# EasyEDA Pro project ProPrj_Anniversary_2026-05-06.epro, board LCD_TFT_Breakout_1in8_128x160
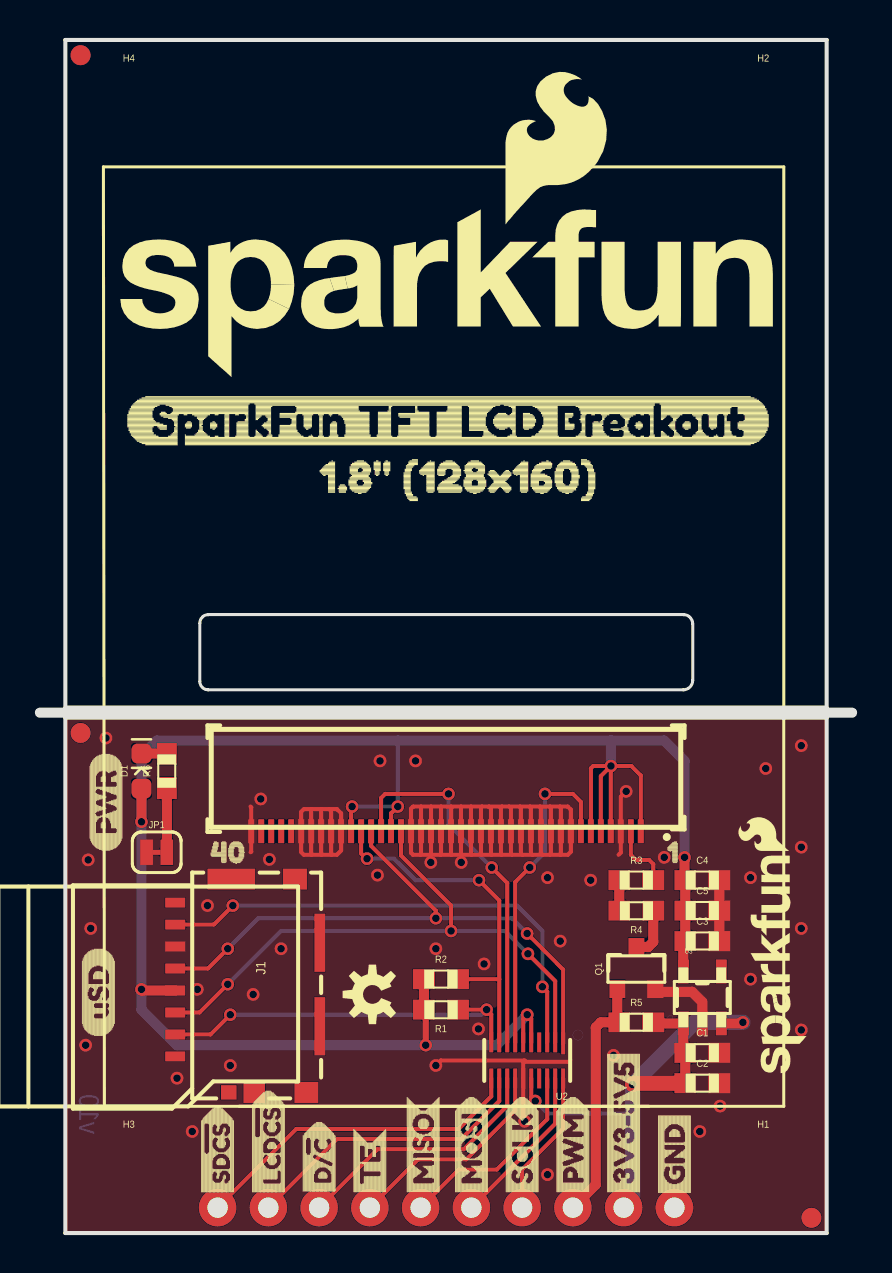
[diagram p3: board, top side]
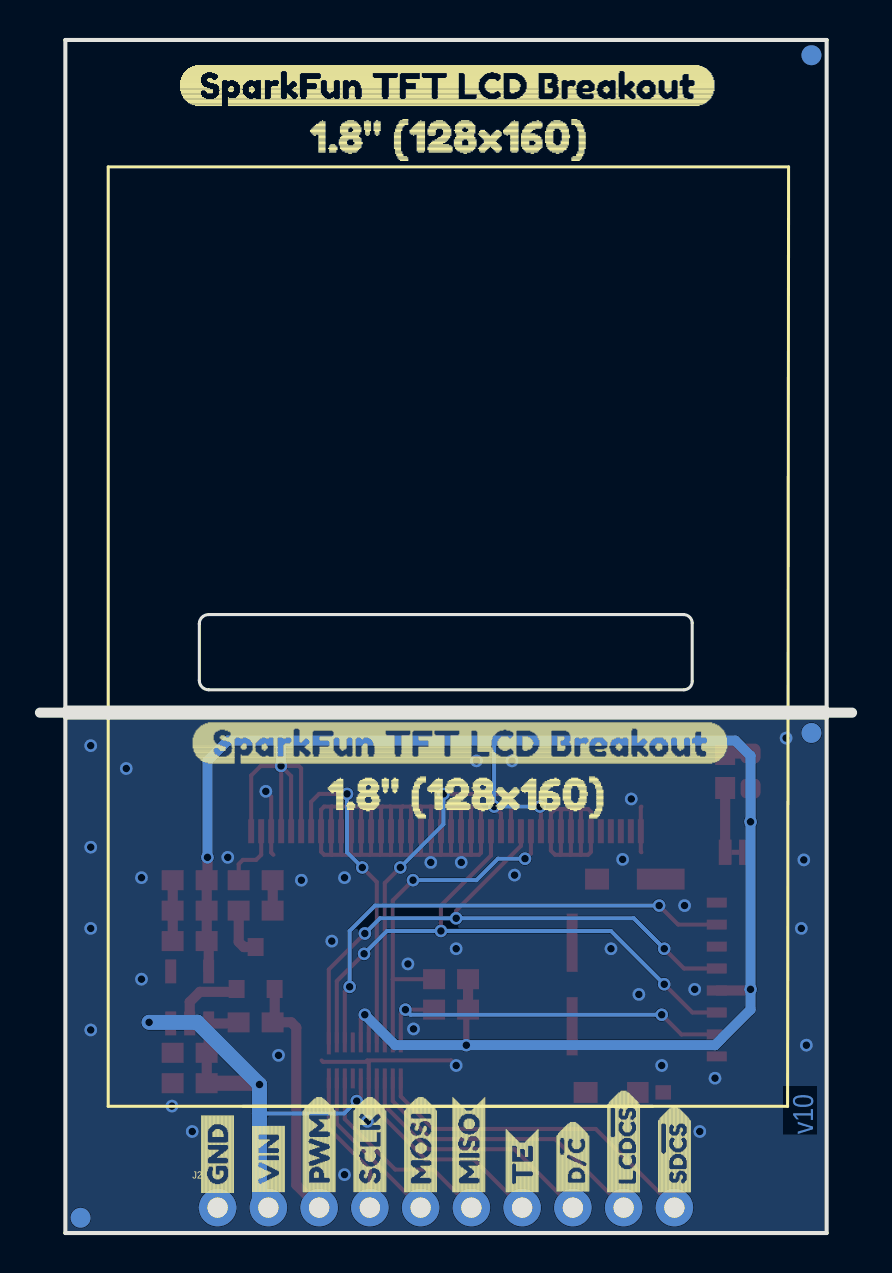
[diagram p4: board, bottom side, seen from below]

Outline 40.64 x 59.69 mm; copper layers: Top Layer, Bottom Layer. Coordinates in mm from the lower left corner of the outline.
Outline path: 0,26.03 40.64,26.03 ; 1.27,59.69 1.27,26.29 39.37,26.29 39.37,59.69 1.27,59.69 ; 1.27,25.78 39.37,25.78 39.37,0 1.27,0 1.27,25.78 ; 8,30.51 arc(8.12,30.81) 8.43,30.94 32.21,30.94 arc(32.53,30.81) 32.67,30.48 32.67,27.65 arc(32.53,27.32) 32.2,27.18 8.42,27.18 arc(8.12,27.3) 8,27.6 8,30.51
Stack: Top Layer 0.035mm / Dielectric1 1.51mm FR4 er 4.5 / Bottom Layer 0.035mm

## Design rules (mm)
spacing safeClearance (default): track to track 0.102, other pairs 0 to 0.102
track width trackWidth: min 0.102, default 0.102, max 2.54
track width default (default): min 0.003, default 0.003, max 2.54
differential pair differentialPair (default): width min 0.127, default 0.254, max 2.54; gap min 0.152, default 0.152
via viaSize: diameter min 0.152, default 0.152, max 2.6; hole min 0.152, default 0.152, max 2
via default (default): diameter min 0, default 0, max 2.6; hole min 0, default 0, max 2
net GND uses CopperRegion1
pour ie27 uses CopperRegion
pour ie28 uses CopperRegion1

## Placement (name value [footprint] x y rotation side)
C1  1.0uF  [0603]  33.15 9.02 0 top
C2  0.1uF  [0603]  33.15 7.49 0 top
C3  4.7uF  [0603]  33.15 14.61 0 top
C4  1.0uF  [0603]  33.15 17.65 0 top
C5  0.1uF  [0603]  33.15 16.13 0 top
D1  RED  [LED-0603]  5.08 23.11 90 top
FD1  FIDUCIAL1X2  [FIDUCIAL-1X2]  2.03 58.93 0 top
FD2  FIDUCIAL1X2  [FIDUCIAL-1X2]  38.61 0.76 0 top
FD3  FIDUCIAL1X2  [FIDUCIAL-1X2]  2.03 58.93 180 bottom
FD4  FIDUCIAL1X2  [FIDUCIAL-1X2]  38.61 0.76 180 bottom
FD5  FIDUCIAL1X2  [FIDUCIAL-1X2]  2.03 25.02 0 top
FD6  FIDUCIAL1X2  [FIDUCIAL-1X2]  2.03 25.02 180 bottom
FRAME1  FRAME-LETTER  [CREATIVE_COMMONS]  1.27 -23.11 0 top
H1  -  [STAND-OFF]  36.2 3.17 0 top
H2  -  [STAND-OFF]  36.2 56.52 0 top
H3  -  [STAND-OFF]  4.45 3.17 0 top
H4  -  [STAND-OFF]  4.45 56.52 0 top
J1  MICRO-SD_CARD_SOCKETTINY  [MICROSD_TINY]  7.62 18.03 270 top
J2  CONN_10NO_SILK_PTH_FEMALE  [1X10_NO_SILK]  31.75 1.27 180 bottom
JP1  LED  [SMT-JUMPER_2_NC_TRACE_SILK]  5.84 19.05 0 top
LOGO1  SFE_LOGO_NAME_FLAME.3_INCH  [SFE_LOGO_NAME_FLAME_.3]  20.32 46.99 0 top
LOGO2  SPECIAL_INSTRUCTIONS-PRODUCTION  [PRODUCTION_INSTRUCTIONS]  -23.24 -40.39 0 top
LOGO3  OSHW-LOGOS  [OSHW-LOGO-S]  16.64 11.94 90 top
Q1  220mA/50V/3.5Ω  [SOT23-3]  29.84 13.21 0 top
R1  10k  [0603]  20.07 11.18 180 top
R2  10k  [0603]  20.07 12.7 0 top
R3  1  [0603]  29.84 17.65 0 top
R4  1  [0603]  29.84 16.13 180 top
R5  10k  [0603]  29.84 10.54 0 top
R6  1k  [0603]  6.35 23.11 90 top
U1  KWH018ST14-F01_4WSPI-BOTTOM  [FPC05040-17204]  20.32 20.7 180 top
U2  TXB0108DQSR  [UFDFN-20]  24.38 8.64 180 top
U3  3.3V  [SOT23-5]  33.15 11.79 0 top
U$1  -  [3V3#5V50]  29.21 1.52 90 top
U$2  -  [SFE_LOGO_NAME_.1]  36.96 13.46 90 top
U$3  -  [SFE_LOGO_FLAME_.1]  36.2 19.94 90 top
U$4  -  [USD2]  2.92 9.78 90 top
U$5  -  [LCD#CS1]  11.43 1.4 90 top
U$6  -  [LCD#CS1]  11.43 1.4 90 bottom
U$7  -  [D##C7]  13.97 1.4 90 bottom
U$8  -  [SD#CS0]  8.89 1.4 90 top
U$9  -  [GND0]  31.75 1.52 90 bottom
U$10  -  [VIN1]  29.21 1.52 90 bottom
U$11  -  [MISO3]  19.18 1.52 90 bottom
U$12  -  [MOSI2]  21.59 1.52 90 bottom
U$13  -  [SCLK4]  24.13 1.52 90 bottom
U$14  -  [TE5]  16.51 1.52 90 bottom
U$15  -  [PWM6]  26.67 1.52 90 bottom
U$16  -  [SD#CS0]  8.89 1.4 90 bottom
U$17  -  [10]  30.48 19.05 0 top
U$18  -  [PWR4]  3.3 19.05 90 top
U$19  -  [SPARKFUN_TFT_LCD_BREAKOUT1]  4.19 40.64 0 top
U$20  -  [1#8#_#128X160#1]  12.67 37.85 0 top
U$21  -  [SPARKFUN_TFT_LCD_BREAKOUT2]  33.78 57.4 180 bottom
U$22  -  [1#8#_#128X160#0]  28.45 54.86 180 bottom
U$23  -  [SPARKFUN_TFT_LCD_BREAKOUT2]  33.15 24.51 180 bottom
U$24  -  [1#8#_#128X160#0]  27.56 21.97 180 bottom
U$25  -  [D##C7]  13.97 1.4 90 top
U$26  -  [MISO3]  19.18 1.52 90 top
U$27  -  [MOSI2]  21.59 1.52 90 top
U$28  -  [SCLK4]  24.13 1.52 90 top
U$29  -  [TE5]  16.51 1.52 90 top
U$30  -  [PWM6]  26.67 1.52 90 top
U$31  -  [401]  7.62 19.05 0 top
U$32  -  [GND0]  31.75 1.52 90 top
U$33  EXTERNAL_DISP-KWH018ST14-F01  [KWH018ST14-F01_HOLES]  3.18 53.34 180 bottom

## Footprints (pads in the part's own frame, mm; a bottom-side part is the same pattern mirrored in y, then rotated)
1X10_NO_SILK
  round 1.879 hole 1.016: 1(0,0) 2(2.54,0) 3(5.08,0) 4(7.62,0) 5(10.16,0) 6(12.7,0) 7(15.24,0) 8(17.78,0) 9(20.32,0) 10(22.86,0)
0603
  rect 1.1x1 smd: 1(-0.85,0) 2(0.85,0)
FIDUCIAL-1X2
  round 1 smd: 1(0,0)
FPC05040-17204
  rect 0.3x1.2 smd: P$1(-9.75,0.6) P$2(-9.25,0.6) P$3(-8.75,0.6) P$4(-8.25,0.6) P$5(-7.75,0.6) P$6(-7.25,0.6) P$7(-6.75,0.6) P$8(-6.25,0.6) P$9(-5.75,0.6) P$10(-5.25,0.6) P$11(-4.75,0.6) P$12(-4.25,0.6) P$13(-3.75,0.6) P$14(-3.25,0.6) P$15(-2.75,0.6) P$16(-2.25,0.6) P$17(-1.75,0.6) P$18(-1.25,0.6) P$19(-0.75,0.6) P$20(-0.25,0.6) P$21(0.25,0.6) P$22(0.75,0.6) P$23(1.25,0.6) P$24(1.75,0.6) P$25(2.25,0.6) P$26(2.75,0.6) P$27(3.25,0.6) P$28(3.75,0.6) P$29(4.25,0.6) P$30(4.75,0.6) P$31(5.25,0.6) P$32(5.75,0.6) P$33(6.25,0.6) P$34(6.75,0.6) P$35(7.25,0.6) P$36(7.75,0.6) P$37(8.25,0.6) P$38(8.75,0.6) P$39(9.25,0.6) P$40(9.75,0.6)
LED-0603
  rrect 1x1 smd: A(-0.877,0) C(0.877,0)
MICROSD_TINY
  rect 0.5x1 smd: 1(9.2,-0.85) 2(8.1,-0.85) 3(7,-0.85) 4(5.9,-0.85) 5(4.8,-0.85) 6(3.7,-0.85) 7(2.6,-0.85) 8(1.5,-0.85)
  rect 0.72x0.78 smd: 9(11,1.83)
  rect 1.05x1.08 smd: GND1(11,3.1)
  rect 1.05x1.2 smd: GND2(11,5.71) GND3(0.325,5.14)
  rect 1.05x2.39 smd: GND4(0.325,1.955)
  rect 2.91x0.55 smd: GND5(3.505,6.385) GND6(7.695,6.385)
SMT-JUMPER_2_NC_TRACE_SILK
  rect 0.635x1.27 smd: 1(-0.508,0) 2(0.508,0)
SOT23-3
  rect 0.8x0.9 smd: 1(-0.95,-1) 2(0.95,-1) 3(0,1.1)
SOT23-5
  rect 0.55x1.2 smd: 1(-0.95,-1.3) 2(0,-1.3) 3(0.95,-1.3) 4(0.95,1.3) 5(-0.95,1.3)
UFDFN-20
  rect 0.2x1.1 smd: 1(-1.8,-0.85)
  rect 0.2x1 smd: 2(-1.4,-0.9) 3(-1,-0.9) 4(-0.6,-0.9) 5(-0.2,-0.9) 6(0.2,-0.9) 7(0.6,-0.9) 8(1,-0.9) 9(1.4,-0.9) 10(1.8,-0.9) 11(1.8,0.9) 12(1.4,0.9) 13(1,0.9) 14(0.6,0.9) 15(0.2,0.9) 16(-0.2,0.9) 17(-0.6,0.9) 18(-1,0.9) 19(-1.4,0.9) 20(-1.8,0.9)

## Nets
3.3V: C3.1 C4.1 C5.1 D1.A J1.4 R1.2 R2.1 U1.P$1 U1.P$4 U1.P$5 U1.P$6 U1.P$26 U1.P$30 U2.5 U2.6 U3.5
GND: C1.2 C2.2 C3.2 C4.2 C5.2 J1.6 J2.1 JP1.1 Q1.2 U1.P$3 U1.P$8 U1.P$9 U1.P$10 U1.P$11 U1.P$12 U1.P$13 U1.P$14 U1.P$15 U1.P$16 U1.P$17 U1.P$18 U1.P$19 U1.P$20 U1.P$21 U1.P$22 U1.P$23 U1.P$24 U1.P$31 U1.P$32 U1.P$33 U1.P$34 U1.P$35 U1.P$40 U2.15 U3.2
VIN: C1.1 C2.1 J2.2 R5.2 U2.16 U3.1 U3.3
!CS: R2.2 U1.P$29 U2.9
!CS!_IN: J2.9 U2.12
D/!C: U1.P$27 U2.8
D/!C!_IN: J2.8 U2.13
LED_PWM: J2.3 Q1.1 R5.1
LEDK: R3.2 U1.P$2
MISO: J1.7 U2.3
MISO_IN: J2.6 U2.18
MOSI: J1.3 U1.P$25 U2.2
MOSI_IN: J2.5 U2.19
N$1: D1.C R6.2
N$2: JP1.2 R6.1
N$3: R3.1 R4.2
N$5: Q1.3 R4.1
SCLK: J1.5 U1.P$28 U2.1
SCLK_IN: J2.4 U2.20
SD_!CS: J1.2 R1.1 U2.10
SD_!CS!_IN: J2.10 U2.11
TE: U1.P$7 U2.7
TE_IN: J2.7 U2.14

Pads without a net: FD1 1; FD2 1; FD3 1; FD4 1; FD5 1; FD6 1; J1 1 8 9 GND1 GND2 GND3 GND4 GND5 GND6; U1 P$36 P$37 P$38 P$39; U2 4 17; U3 4

## Via types
v1: diameter 0.635, hole 0.381, Top Layer to Bottom Layer, 66 vias

## Routing (per net, layer and track width the routed paths; a pad name or vN(x,y) marks a point on that pad's centre or on a via; arc(x,y) is an arc through that point)
3.3V: length 106.4
  Top Layer w0.203: 28.57,23.36 28.07,22.86 U1.P$5 ; 28.57,23.36 U1.P$4 ; 28.57,23.36 28.56,23.37 27.69,23.37 27.57,23.25 U1.P$6 ; 28.57,23.36 29.6,23.36 30.07,22.89 U1.P$1 ; 28.57,23.36 v1(28.58,23.37) ; U2.6 24.18,10.72 v1(24.38,10.92) 24.58,10.72 U2.5 ; v1(15.62,21.34) 15.57,21.28 U1.P$30 ; U1.P$26 17.57,21 v1(17.91,21.34)
  Top Layer w0.305: v1(19.3,9.4) 19.3,11.09 R1.2
  Top Layer w0.508: v1(5.08,12.19) 5.14,12.13 J1.4 ; R2.1 R1.2 ; 5.08,22.24 v1(5.08,20.57) ; v1(32.26,18.8) 32.26,17.69 C4.1 C5.1 C3.1 32.2,14.5 U3.5
  Bottom Layer w0.203: 17.91,24.64 v1(17.91,21.34) v1(15.62,21.34)
  Bottom Layer w0.508: 28.58,24.64 5.84,24.64 5.08,23.88 v1(5.08,20.57) v1(5.08,12.19) 5.08,11.18 6.86,9.4 v1(19.3,9.4) 22.86,9.4 v1(24.38,10.92) ; 28.58,24.64 v1(28.58,23.37) ; 28.58,24.64 31.24,24.64 32.26,23.62 v1(32.26,18.8)
GND: length 94.7
  Top Layer w0.203: 23.5,21.34 23.57,21.26 U1.P$14 23.57,18.97 23.62,18.92 ; 23.5,21.34 23.11,21.34 ; 23.5,21.34 24,21.34 ; 19.56,18.92 20.07,18.92 ; 19.56,18.92 19.05,18.92 ; 19.56,18.92 19.57,18.94 U1.P$22 19.57,21.32 19.56,21.34 ; 20.07,18.92 20.57,18.92 ; 20.07,18.92 20.07,18.93 U1.P$21 20.07,21.33 20.07,21.34 ; 26.03,21.34 26.07,21.3 U1.P$9 26.07,18.96 26.03,18.92 ; 26.03,21.34 25.53,21.34 ; 26.03,21.34 26.42,21.34 26.57,21.18 U1.P$8 26.57,19.08 26.42,18.92 26.03,18.92 ; 23.62,18.92 23.11,18.92 ; 23.62,18.92 24.13,18.92 ; 13.59,21.21 13.21,21.21 13.07,21.07 U1.P$35 13.07,19.06 13.21,18.92 13.59,18.92 ; 13.59,21.21 13.57,21.19 U1.P$34 13.57,18.94 13.59,18.92 ; 13.59,21.21 14.1,21.21 ; 22.61,18.92 22.57,18.96 U1.P$16 22.57,21.25 22.48,21.34 ; 22.61,18.92 23.11,18.92 ; 22.61,18.92 22.1,18.92 ; 23.11,21.34 23.07,21.29 U1.P$15 23.07,18.97 23.11,18.92 ; 23.11,21.34 22.48,21.34 ; 10.54,19.05 10.57,19.08 U1.P$40 10.57,21.31 10.54,21.34 ; 20.57,18.92 21.08,18.92 ; 20.57,18.92 20.57,18.93 U1.P$20 20.57,20.11 20.57,21.34 ; 21.08,18.92 21.07,18.94 U1.P$19 21.07,21.32 21.08,21.34 ; 21.08,18.92 21.59,18.92 ; 20.07,21.34 19.56,21.34 ; 20.07,21.34 20.57,21.34 ; 14.1,18.92 14.07,18.95 U1.P$33 14.07,21.18 14.1,21.21 ; 14.1,18.92 13.59,18.92 ; 14.1,18.92 14.61,18.92 ; 19.05,18.92 19.07,18.94 U1.P$23 19.07,21.32 19.05,21.34 ; 19.05,18.92 18.67,18.92 18.57,19.02 U1.P$24 18.57,21.24 18.67,21.34 19.05,21.34 ; 25.15,18.92 25.07,19 U1.P$11 25.07,21.28 25.02,21.34 ; 25.15,18.92 25.53,18.92 ; 25.15,18.92 24.64,18.92 ; 25.53,18.92 26.03,18.92 ; 25.53,18.92 25.57,18.97 U1.P$10 25.57,21.29 25.53,21.34 ; 19.05,21.34 19.56,21.34 ; 21.08,21.34 20.57,21.34 ; 21.08,21.34 21.59,21.34 ; 21.59,21.34 22.1,21.34 ; 21.59,21.34 21.57,21.32 U1.P$18 21.57,18.94 21.59,18.92 ; 22.1,21.34 22.07,21.31 U1.P$17 22.07,18.95 22.1,18.92 ; 22.1,21.34 22.48,21.34 ; 24.13,18.92 24.07,18.98 U1.P$13 24.07,21.27 24,21.34 ; 24.13,18.92 24.64,18.92 ; 21.59,18.92 22.1,18.92 ; 24.18,8.56 26.47,8.56 26.54,8.64 ; 24.18,8.56 24.26,8.64 20.07,8.64 v1(19.81,8.38) ; 24.18,8.56 U2.15 24.18,5.66 v1(24.26,5.59) ; 24,21.34 24.51,21.34 ; 24.51,21.34 25.02,21.34 ; 24.51,21.34 24.57,21.28 U1.P$12 24.57,18.99 24.64,18.92 ; 25.02,21.34 25.53,21.34 ; 14.48,21.21 14.86,21.21 15.07,21 U1.P$31 15.07,19.13 14.86,18.92 14.61,18.92 ; 14.48,21.21 14.1,21.21 ; 14.48,21.21 14.57,21.12 U1.P$32 14.57,18.96 14.61,18.92 ; v1(29.34,22.1) 29.07,21.83 U1.P$3 29.07,19.04 28.96,18.92
  Top Layer w0.508: C3.2 C5.2 C4.2 ; U3.2 33.15,11.56 32.64,12.06 30.94,12.06 Q1.2
  vias: v1(2.29,9.4) v1(2.41,18.67) v1(2.54,15.24) v1(3.3,24.77) v1(6.86,7.75) v1(7.62,5.08) v1(7.87,12.19) v1(8.38,16.38) v1(9.53,8.38) v1(10.67,11.94) v1(11.05,21.72) v1(11.48,18.69) v1(12.06,14.22) v1(16.89,17.91) v1(17.02,23.62) v1(18.8,23.62) v1(19.56,18.54) v1(19.81,14.22) v1(21.08,18.54) v1(21.95,10.21) v1(22.23,13.46) v1(25.4,17.78) v1(25.4,2.92) v1(26.03,14.61) v1(27.56,17.65) v1(28.7,8.89) v1(31.24,18.8) v1(33.02,5.08) v1(34.04,6.35) v1(35.56,17.78) v1(35.56,12.7) v1(36.32,23.24) v1(38.1,24.38) v1(38.1,19.3) v1(38.1,15.24) v1(38.1,10.16)
VIN: length 27.8
  Top Layer w0.203: U2.16 24.58,6.81 v1(24.79,6.6)
  Top Layer w0.508: v1(35.18,10.54) 35.12,10.49 U3.3 ; C2.1 C1.1 32.2,9.12 U3.1 30.75,10.49 R5.2
  Top Layer w0.762: C2.1 29.72,7.49 v1(29.65,7.43)
  Bottom Layer w0.203: 29.65,5.98 25.41,5.98 v1(24.79,6.6)
  Bottom Layer w0.762: J2.2 29.65,1.71 v1(29.65,7.43) 32.77,10.54 v1(35.18,10.54)
!CS: length 18.2
  Top Layer w0.203: U1.P$29 16.07,18.99 16.33,18.73 v1(16.37,18.73) ; 22.98,12.7 22.98,16.64 v1(21.97,17.65) ; 22.98,12.7 R2.2 ; 22.98,12.7 U2.9
  Bottom Layer w0.203: v1(16.37,18.73) 17.72,18.73 18.8,17.65 v1(21.97,17.65)
!CS!_IN: length 14.9
  Top Layer w0.203: U2.12 22.98,6.6 21.08,4.7 14.86,4.7 J2.9
D/!C: length 18.8
  Top Layer w0.203: U1.P$27 17.07,21.77 17.27,21.97 v1(20.45,21.97) ; U2.8 23.38,17.51 v1(22.61,18.29)
  Bottom Layer w0.203: v1(20.45,21.97) 20.45,20.45 v1(22.61,18.29)
D/!C!_IN: length 12.9
  Top Layer w0.203: J2.8 16.89,4.19 21.21,4.19 23.38,6.37 U2.13
LED_PWM: length 12.5
  Top Layer w0.508: Q1.1 28.9,10.64 R5.1 28.07,10.54 27.81,10.29 27.81,2.41 J2.3
LEDK: length 3.3
  Top Layer w0.203: R3.2 30.7,18.45 30.48,18.67 29.82,18.67 29.57,18.92 U1.P$2
MISO: length 25
  Top Layer w0.203: v1(9.65,16.38) 8.7,15.43 J1.7 ; v1(25.14,12.32) 25.38,12.08 U2.3
  Bottom Layer w0.203: v1(9.65,16.38) 23.87,16.38 25.14,15.11 v1(25.14,12.32)
MISO_IN: length 10.2
  Top Layer w0.203: U2.18 25.38,5.7 22.86,3.17 20.96,3.17 J2.6
MOSI: length 30.8
  Top Layer w0.203: U1.P$25 18.07,18.89 20.57,16.38 v1(20.57,15.11) ; v1(9.4,12.45) 7.99,11.03 J1.3 ; U2.2 25.78,12.61 v1(24.42,13.97)
  Bottom Layer w0.203: v1(9.4,12.45) 12.06,15.11 v1(20.57,15.11) 23.28,15.11 v1(24.42,13.97)
MOSI_IN: length 8.2
  Top Layer w0.203: U2.19 25.78,5.46 J2.5
N$1: length 1.3
  Top Layer w0.508: D1.C 6.32,23.99 R6.2
N$2: length 3.2
  Top Layer w0.508: JP1.2 R6.1
N$3: length 1.5
  Top Layer w0.508: R4.2 R3.1
N$5: length 2.5
  Top Layer w0.508: Q1.3 30.44,14.31 30.7,14.57 R4.1
SCLK: length 30.9
  Top Layer w0.203: U2.1 26.18,13.18 v1(24.38,14.99) ; v1(19.81,15.75) 19.81,16.13 16.57,19.37 U1.P$28 ; J1.5 8.41,13.23 v1(9.4,14.22)
  Bottom Layer w0.203: v1(24.38,14.99) 23.62,15.75 v1(19.81,15.75) 10.92,15.75 v1(9.4,14.22)
SCLK_IN: length 7.3
  Top Layer w0.203: U2.20 26.18,5.23 24.13,3.17 J2.4
SD_!CS: length 19.3
  Top Layer w0.203: U2.10 22.58,10.94 v1(22.35,11.18) R1.1 ; J1.2 8.54,9.93 v1(9.53,10.92)
  Bottom Layer w0.203: v1(22.35,11.18) 22.1,10.92 v1(9.53,10.92)
SD_!CS!_IN: length 16.9
  Top Layer w0.203: J2.10 12.83,5.21 20.96,5.21 22.58,6.84 U2.11
TE: length 16.5
  Top Layer w0.203: U2.7 23.78,17.56 v1(24.51,18.29) ; v1(25.27,21.97) 26.67,21.97 27.07,21.57 U1.P$7
  Bottom Layer w0.203: v1(24.51,18.29) 25.27,19.05 v1(25.27,21.97)
TE_IN: length 10.9
  Top Layer w0.203: J2.7 18.92,3.68 21.34,3.68 23.78,6.13 U2.14

## Copper pours and planes (outline as drawn; the poured copper is in the pictures)
GND on Top Layer: 1.27,0 39.37,0 39.37,26.29 1.27,26.29
GND on Bottom Layer: 1.27,0 1.27,26.29 39.37,26.29 39.37,0

## Text on the board
Bottom Layer: v10
Mechanical Layer: Route Out
Top Silkscreen Layer: When panelizing please extend the mid-board v-score lines across / the panel without changing location. This is a break-away option / for the user | Owen Lyke
Ratline Layer: IN
